# Altium schematic sheet RADC-Connectors-S01-V00.SchDoc: RADC Connectors (2x MX120G, Dual CANBUS, USB Header)
size A3; DrawnBy: Jonn Dillon; DocumentNumber: 2; SheetNumber: 2; SheetTotal: 8; Version: 00; Project: QUTMS RADIO COMPUTE; PageSetup: Record=PageOptions|CenterHorizontal=True|CenterVertical=True|PrintScale=0.97|XCorrection=1.00|YCorrection=1.00|PrintKind=0|BorderSize=5000000|LeftOffset=0|BottomOffset=0|Orientation=2|PaperLength=1000|PaperWidth=1000|Scale=100|PaperSource=7|PrintQuality=-4|MediaType=1|DitherType=10|PaperKind=A4|PrintScaleMode=1
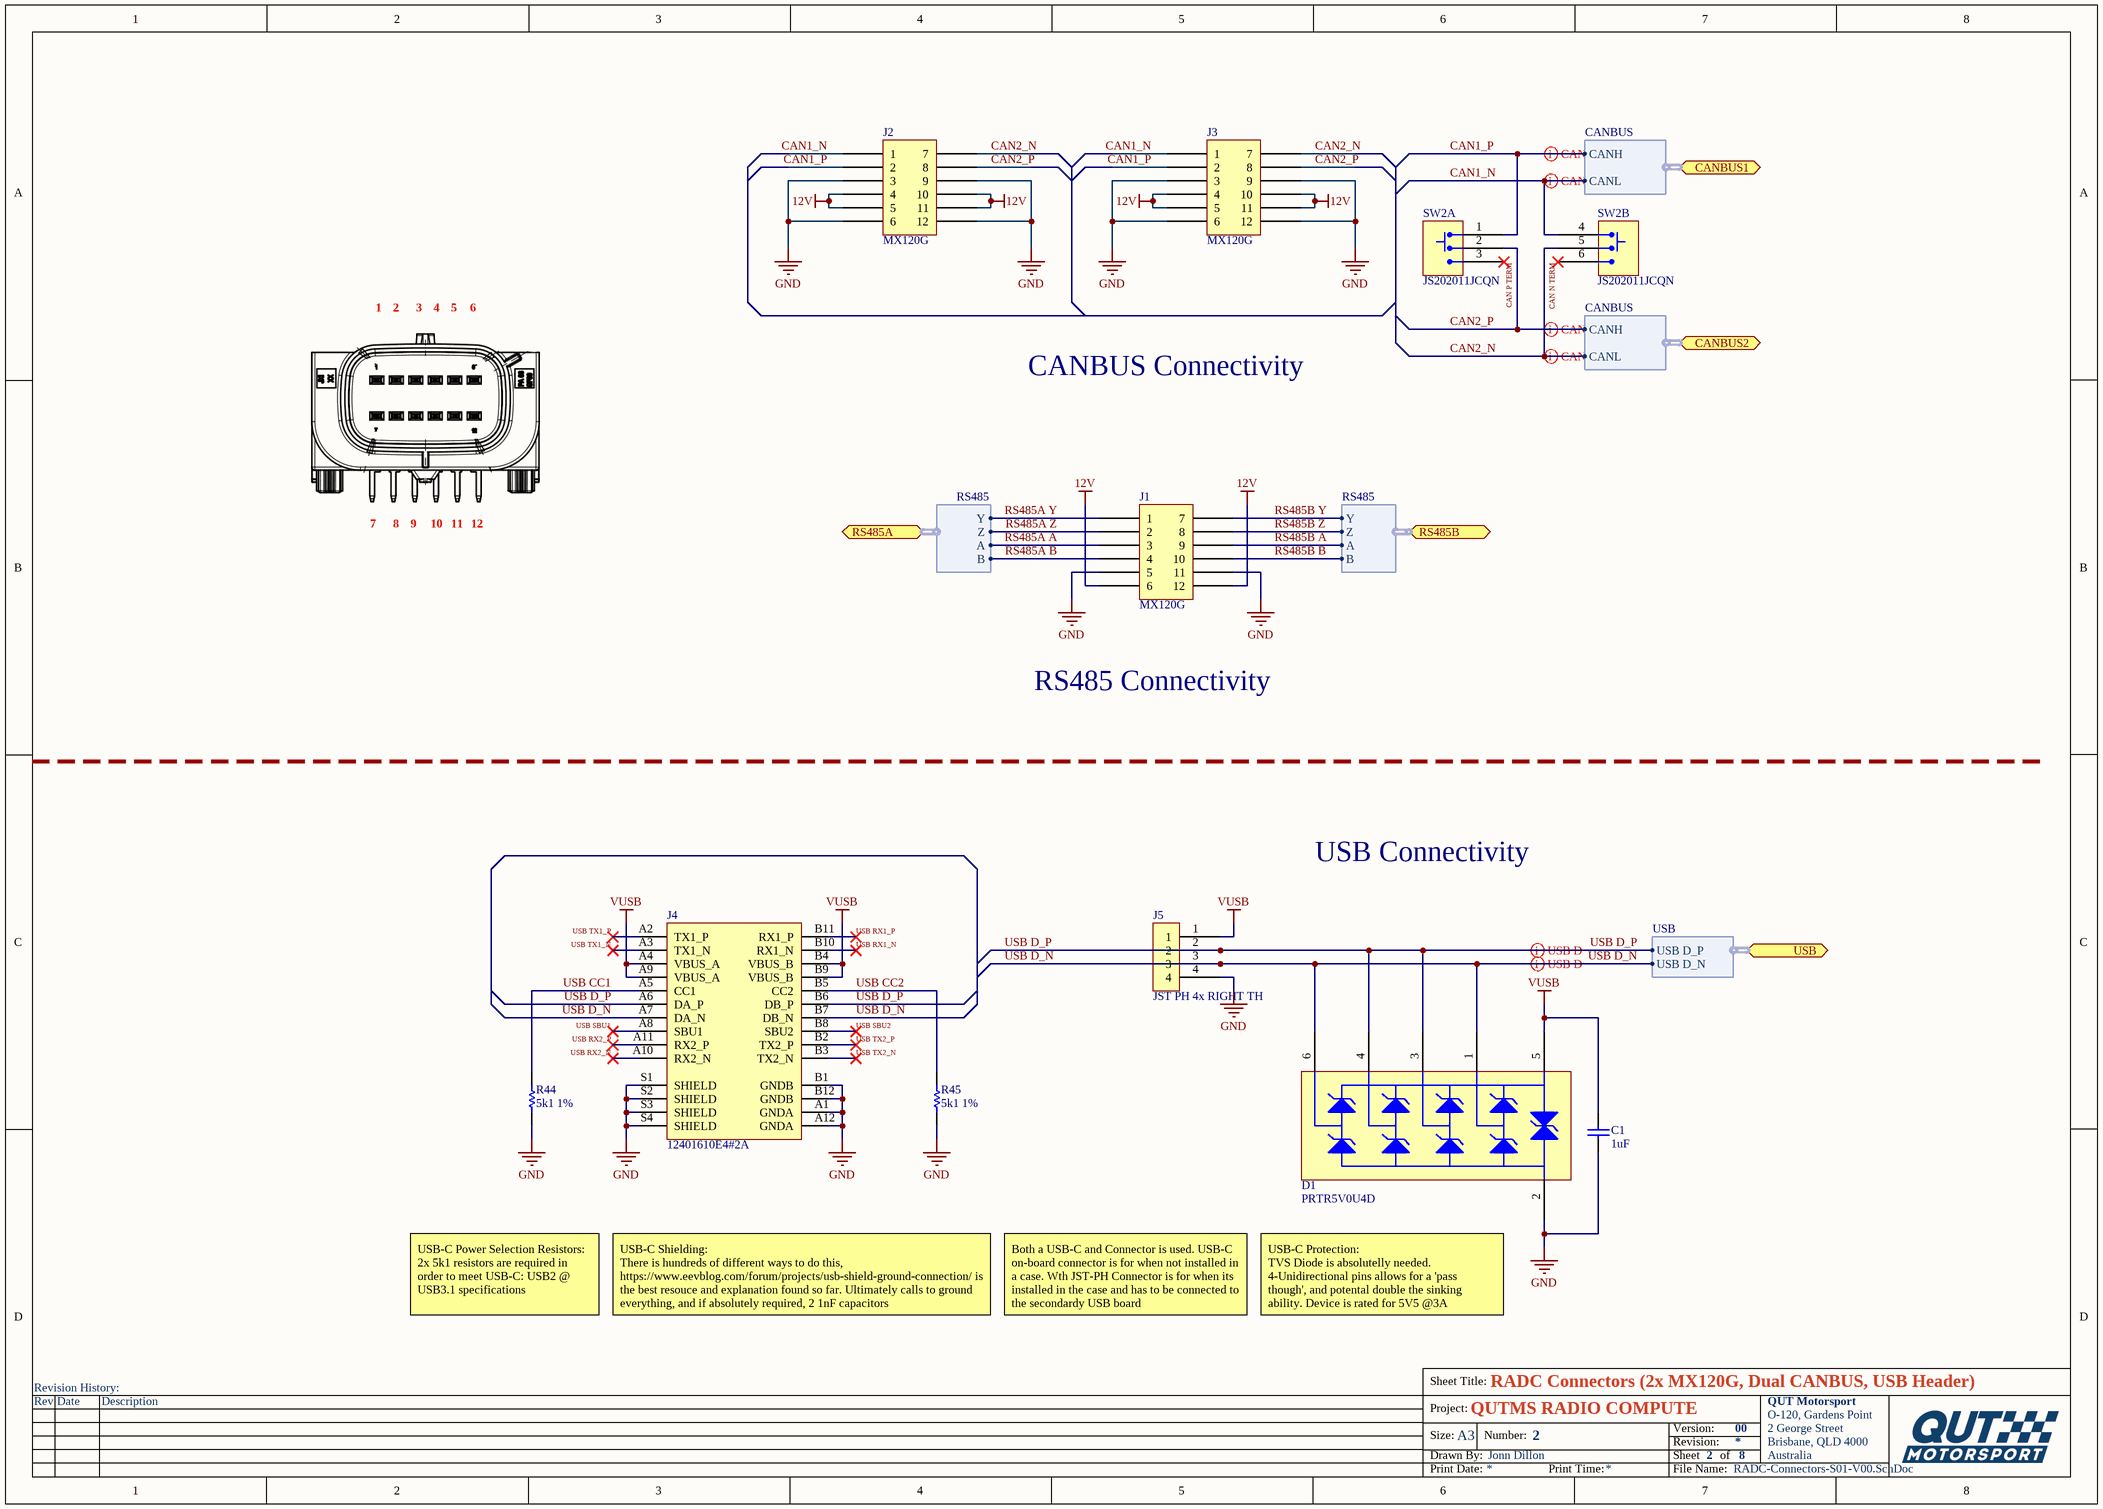
[diagram p0: RADC-Connectors-S01-V00.SchDoc]

## Parts
C1  1uF  [Cap_Ceramic_0603]
D1  PRTR5V0U4D  [SC-47]
J1  MX120G  [MX120G]
J2  MX120G  [MX120G]
J3  MX120G  [MX120G]
J4  12401610E4#2A  [12401610E4#2A]
J5  JST PH 4x RIGHT TH  [JST PH 4x RIGHT TH]
R44  5k1 1%  [Res_ThinFilm_0603]
R45  5k1 1%  [Res_ThinFilm_0603]
SW2  JS202011JCQN  [JS202011JCQN]  (parts A,B of 2)

## Ports
CANBUS1 (bidir, harness CANBUS), CANBUS2 (bidir, harness CANBUS), RS485A (bidir, harness RS485), RS485B (bidir, harness RS485), USB (bidir, harness USB)

## Harnesses
USB: USB D_P, USB D_N
RS485: Y, Z, A, B
CANBUS: CANH, CANL

## Nets
12V: J1.6 J1.12 J2.4 J2.5 J2.10 J2.11 J3.4 J3.5 J3.10 J3.11
GND: C1.1 D1.2(GND) J1.5 J1.11 J2.3 J2.6 J2.9 J2.12 J3.3 J3.6 J3.9 J3.12 J4.A1(GNDA) J4.A12(GNDA) J4.B1(GNDB) J4.B12(GNDB) J4.S1(SHIELD) J4.S2(SHIELD) J4.S3(SHIELD) J4.S4(SHIELD) J5.4 R44.1 R45.1
VUSB: C1.2 D1.5(VCC) J4.A4(VBUS_A) J4.A9(VBUS_A) J4.B4(VBUS_B) J4.B9(VBUS_B) J5.1
CAN1_N: J2.1 J3.1 SW2.4 ; port CANBUS1.CANL
CAN1_P: J2.2 J3.2 SW2.1 ; port CANBUS1.CANH
CAN2_N: J2.7 J3.7 SW2.5 ; port CANBUS2.CANL
CAN2_P: J2.8 J3.8 SW2.2 ; port CANBUS2.CANH
CAN N TERM: SW2.6
CAN P TERM: SW2.3
RS485A A: J1.3 ; port RS485A.A
RS485A B: J1.4 ; port RS485A.B
RS485A Y: J1.1 ; port RS485A.Y
RS485A Z: J1.2 ; port RS485A.Z
RS485B A: J1.9 ; port RS485B.A
RS485B B: J1.10 ; port RS485B.B
RS485B Y: J1.7 ; port RS485B.Y
RS485B Z: J1.8 ; port RS485B.Z
USB CC1: J4.A5(CC1) R44.2
USB CC2: J4.B5(CC2) R45.2
USB D_N: D1.1(P1) D1.6(P4) J4.A7(DA_N) J4.B7(DB_N) J5.3 ; port USB.USB D_N
USB D_P: D1.3(P2) D1.4(P3) J4.A6(DA_P) J4.B6(DB_P) J5.2 ; port USB.USB D_P
USB RX1_N: J4.B10(RX1_N)
USB RX1_P: J4.B11(RX1_P)
USB RX2_N: J4.A10(RX2_N)
USB RX2_P: J4.A11(RX2_P)
USB SBU1: J4.A8(SBU1)
USB SBU2: J4.B8(SBU2)
USB TX1_N: J4.A3(TX1_N)
USB TX1_P: J4.A2(TX1_P)
USB TX2_N: J4.B3(TX2_N)
USB TX2_P: J4.B2(TX2_P)

## Layout directives
differential pair: CAN1_N, CAN1_P, CAN2_N, CAN2_P, USB D_N, USB D_P

## Notes on the sheet
- 1
- 2
- 3
- 4
- 5
- 6
- CANBUS Connectivity
- 7
- 8
- 9
- 10
- 11
- 12
- RS485 Connectivity
- USB Connectivity
- USB-C Power Selection Resistors:
  2x 5k1 resistors are required in order to meet USB-C: USB2 @ USB3.1 specifications
- USB-C Shielding:
  There is hundreds of different ways to do this, https://www.eevblog.com/forum/projects/usb-shield-ground-connection/ is the best resouce and explanation found so far. Ultimately calls to ground everything, and if absolutely required, 2 1nF capacitors
- Both a USB-C and Connector is used. USB-C on-board connector is for when not installed in a case. Wth JST-PH Connector is for when its installed in the case and has to be connected to the secondardy USB board
- USB-C Protection:
  TVS Diode is absolutelly needed. 4-Unidirectional pins allows for a 'pass though', and potental double the sinking ability. Device is rated for 5V5 @3A
- Revision History:
- Sheet Title:
- Rev
- Date
- Description
- Project:
- Size:
- Drawn By:
- A3
- Number:
- Revision:
- Sheet
- Version:
- of
- QUT Motorsport
- O-120, Gardens Point
- 2 George Street
- Brisbane, QLD 4000
- Australia
- Print Date:
- Print Time:
- File Name:

## Library data of the parts
C1 = 1uF 25V 5% X7R 0603: Capacitor, Ceramic, SMD, 1uF, 25V, 5%, X7R, 0603
D1 = PRTR5V0U4D: Clamp Ipp Tvs Diode Surface Mount 6-TSOP
J1-J3 = MX120G: MX120G with standard connector layout
J4 = 12401610E4#2A: USB-C (USB TYPE-C) USB 3.2 Gen 2 (USB 3.1 Gen 2, Superspeed + (USB 3.1)) Receptacle Connector 24 Position Surface Mount, Right Angle; Through Hole
R44 R45 = 5k1 1% 0603: Resistor, SMD, 5k1, 0.1W, 1%, 0603
SW2 = SLIDE DPDT JS202011JCQN